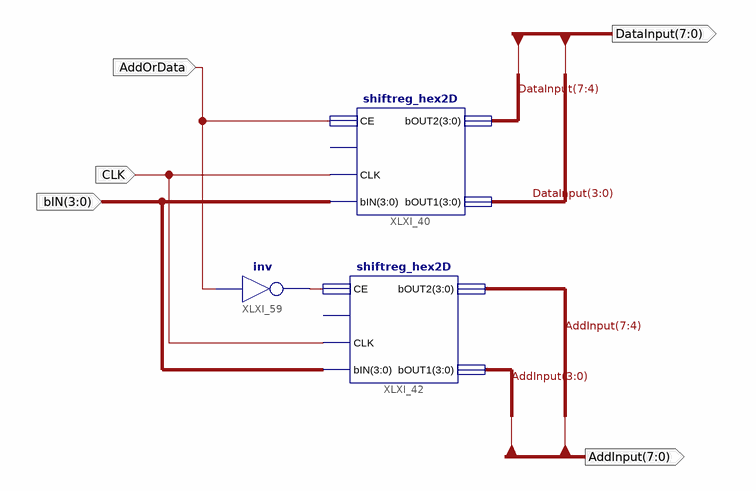
[diagram p0: schematic sheet 1]
// Xilinx ISE schematic keypad_shift.sch (spartan3e) as structural Verilog: 3 symbols, 5 ports
module keypad_shift (
  input  AddOrData,
  input  [3:0] bIN,
  input  CLK,
  output [7:0] DataInput,
  output [7:0] AddInput
);

  wire XLXN_126;

  shiftreg_hex2D XLXI_42 (
    .CLK(CLK), .bIN(bIN), .CE(XLXN_126), .bOUT1(AddInput[3:0]), .bOUT2(AddInput[7:4]));  // open: RST
  shiftreg_hex2D XLXI_40 (
    .CLK(CLK), .bIN(bIN), .CE(AddOrData), .bOUT1(DataInput[3:0]), .bOUT2(DataInput[7:4]));  // open: RST
  not XLXI_59 (XLXN_126, AddOrData);
endmodule
